# EAGLE design Indev 4 arduino (EAGLE 6.3)

## Sheet 1 of 2
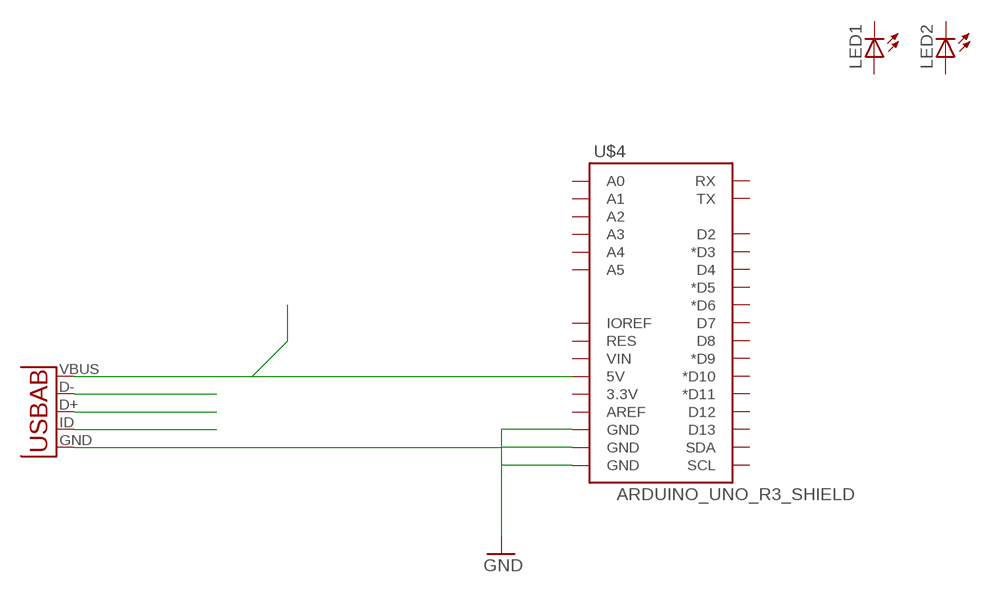
[diagram p0: schematic, sheet 1]

### Parts
LED1  LED0603  [LED-0603]
LED2  LED0603  [LED-0603]
U1  USB-AB  [USB-AB-MICRO-SMD]
U$4  ARDUINO_UNO_R3_SHIELD  [ARDUINO_UNO_R3_SHIELD]

### Nets
GND: U1.GND U$4.GND@0(GND) U$4.GND@1(GND) U$4.GND@2(GND) ; also sheet 2
USB_ID: U1.ID(USBID)
USB_VBUS: U1.VBUS U$4.5V
USBD_N: U1.D- ; also sheet 2
USBD_P: U1.D+ ; also sheet 2
Unconnected: LED1.A LED1.C LED2.A LED2.C U$4.3.3V U$4.A0 U$4.A1 U$4.A2 U$4.A3 U$4.A4 U$4.A5 U$4.AREF U$4.D2 U$4.D3(*D3) U$4.D4 U$4.D5(*D5) U$4.D6(*D6) U$4.D7 U$4.D8 U$4.D9(*D9) U$4.D10(*D10) U$4.D11(*D11) U$4.D12 U$4.D13 U$4.IOREF U$4.RES U$4.RX U$4.SCL U$4.SDA U$4.TX U$4.VIN

## Sheet 2 of 2
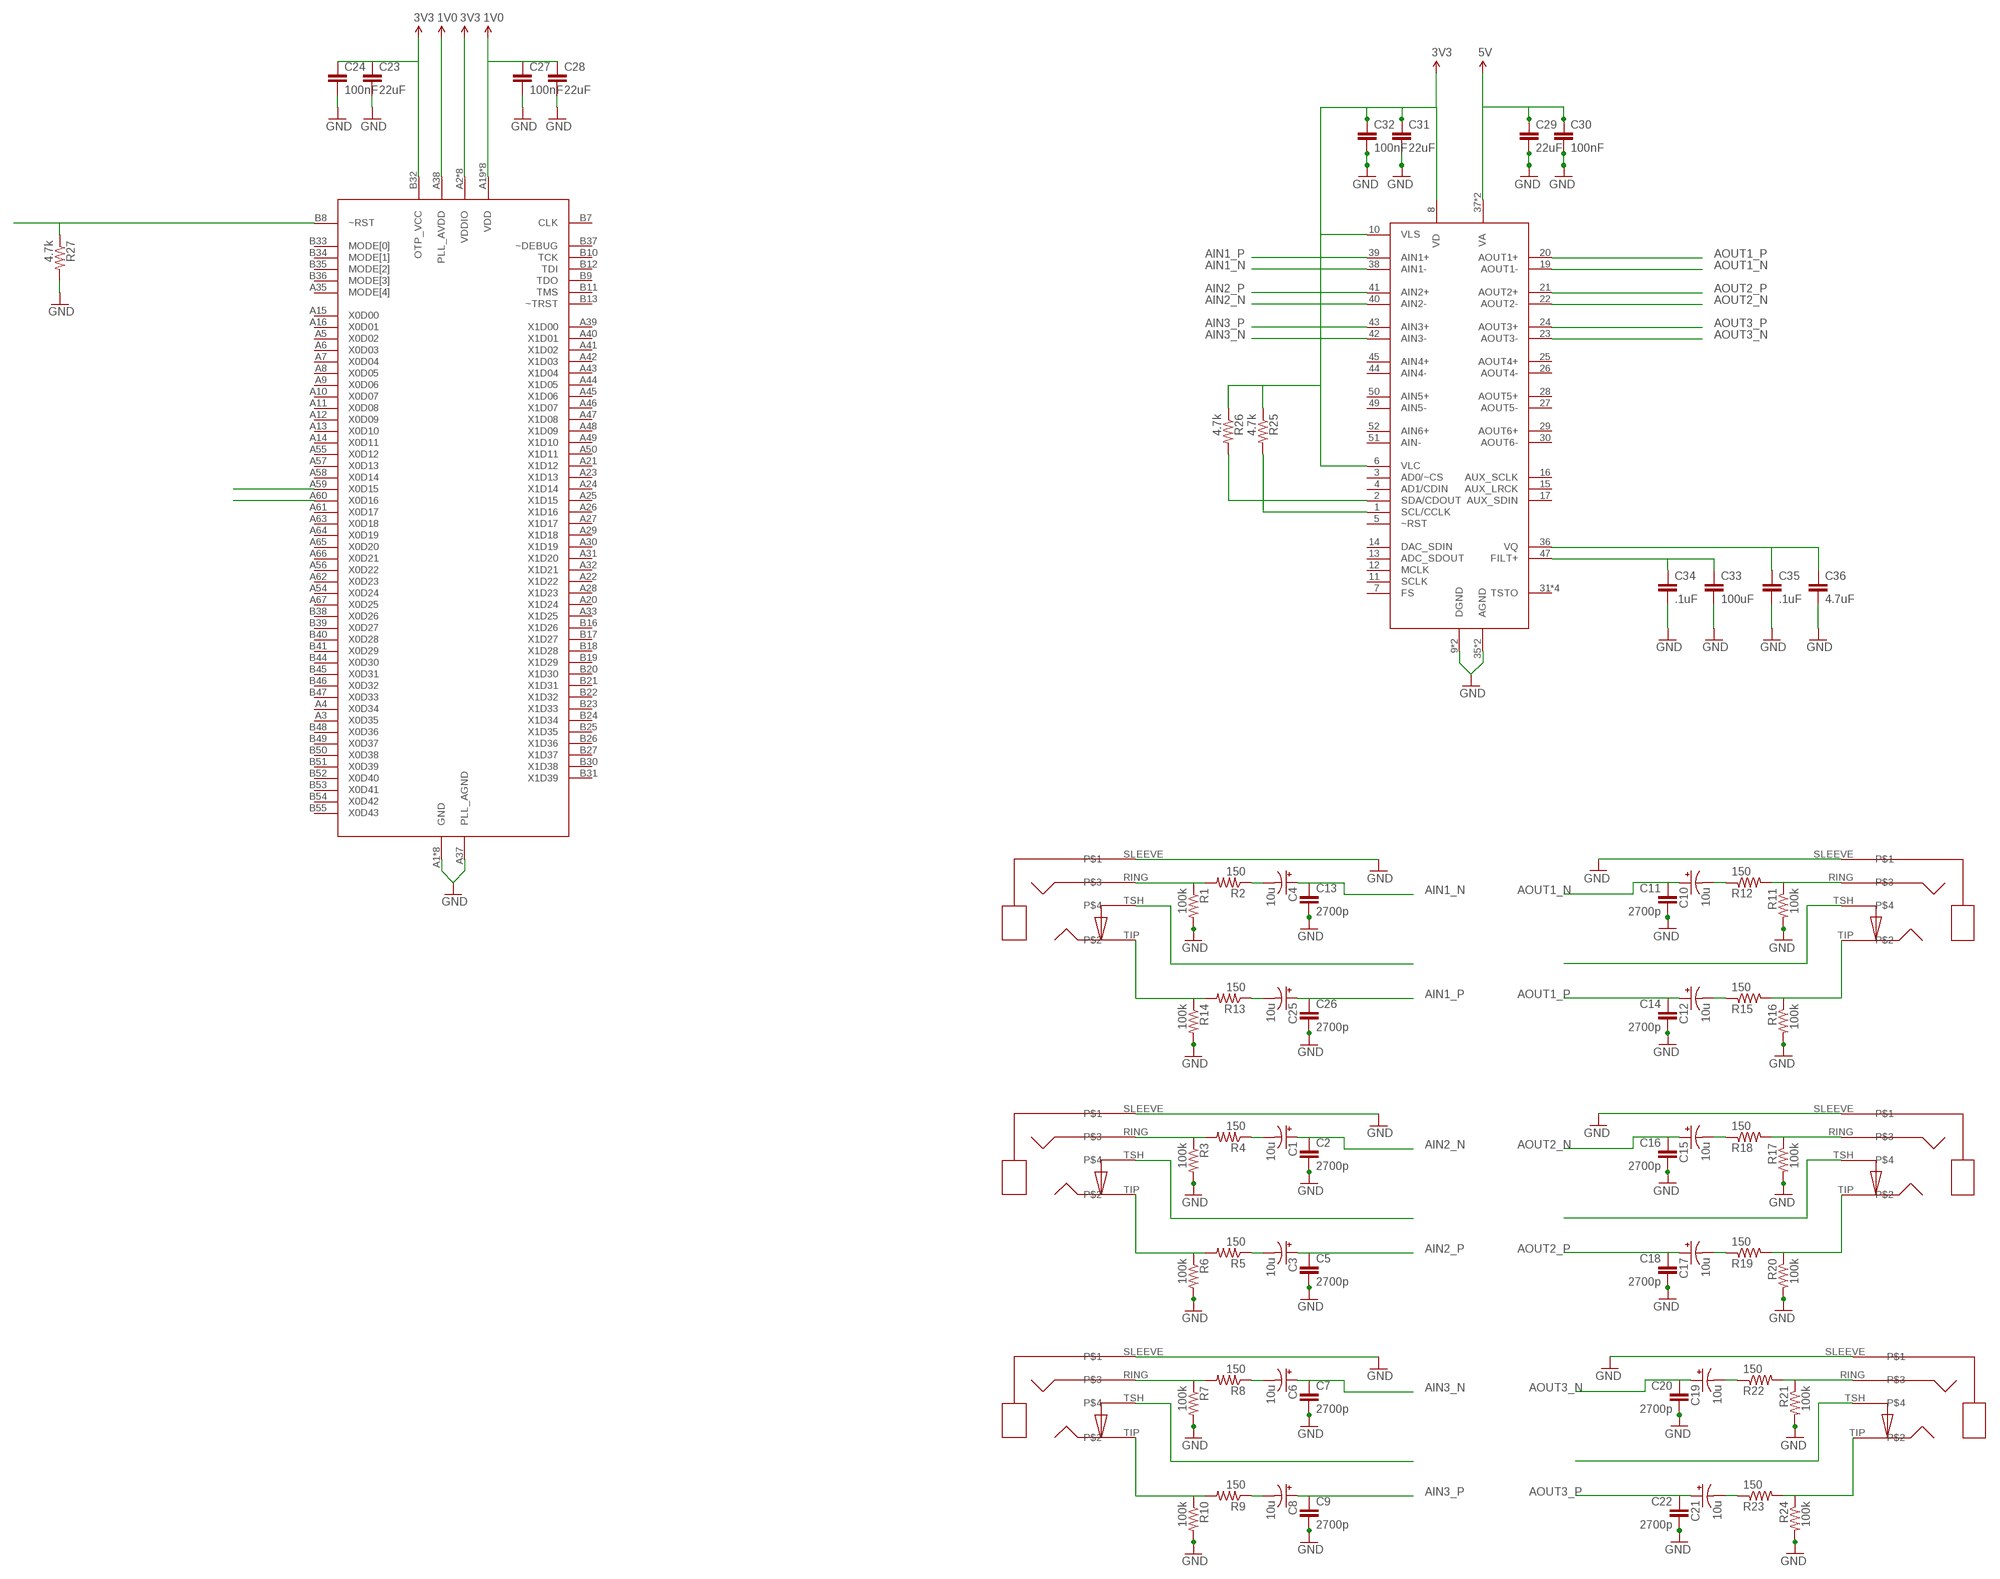
[diagram p1: schematic, sheet 2]

### Parts
C1  10u  CPOL-USB  [PANASONIC_B]
C2  2700p  CAP0402-CAP  [0402-CAP]
C3  10u  CPOL-USB  [PANASONIC_B]
C4  10u  CPOL-USB  [PANASONIC_B]
C5  2700p  CAP0402-CAP  [0402-CAP]
C6  10u  CPOL-USB  [PANASONIC_B]
C7  2700p  CAP0402-CAP  [0402-CAP]
C8  10u  CPOL-USB  [PANASONIC_B]
C9  2700p  CAP0402-CAP  [0402-CAP]
C10  10u  CPOL-USB  [PANASONIC_B]
C11  2700p  CAP0402-CAP  [0402-CAP]
C12  10u  CPOL-USB  [PANASONIC_B]
C13  2700p  CAP0402-CAP  [0402-CAP]
C14  2700p  CAP0402-CAP  [0402-CAP]
C15  10u  CPOL-USB  [PANASONIC_B]
C16  2700p  CAP0402-CAP  [0402-CAP]
C17  10u  CPOL-USB  [PANASONIC_B]
C18  2700p  CAP0402-CAP  [0402-CAP]
C19  10u  CPOL-USB  [PANASONIC_B]
C20  2700p  CAP0402-CAP  [0402-CAP]
C21  10u  CPOL-USB  [PANASONIC_B]
C22  2700p  CAP0402-CAP  [0402-CAP]
C23  22uF  CAP0402-CAP  [0402-CAP]
C24  100nF  CAP0402-CAP  [0402-CAP]
C25  10u  CPOL-USB  [PANASONIC_B]
C26  2700p  CAP0402-CAP  [0402-CAP]
C27  100nF  CAP0402-CAP  [0402-CAP]
C28  22uF  CAP0402-CAP  [0402-CAP]
C29  22uF  CAP0402-CAP  [0402-CAP]
C30  100nF  CAP0402-CAP  [0402-CAP]
C31  22uF  CAP0402-CAP  [0402-CAP]
C32  100nF  CAP0402-CAP  [0402-CAP]
C33  100uF  CAP0402-CAP  [0402-CAP]
C34  .1uF  CAP0402-CAP  [0402-CAP]
C35  .1uF  CAP0402-CAP  [0402-CAP]
C36  4.7uF  CAP0402-CAP  [0402-CAP]
J1  SJ3524_AUDIO  [SJ3524_AUDIO]
J2  SJ3524_AUDIO  [SJ3524_AUDIO]
J3  SJ3524_AUDIO  [SJ3524_AUDIO]
J4  SJ3524_AUDIO  [SJ3524_AUDIO]
J5  SJ3524_AUDIO  [SJ3524_AUDIO]
J6  SJ3524_AUDIO  [SJ3524_AUDIO]
R1  100k  R-US_R0402  [R0402]
R2  150  R-US_R0402  [R0402]
R3  100k  R-US_R0402  [R0402]
R4  150  R-US_R0402  [R0402]
R5  150  R-US_R0402  [R0402]
R6  100k  R-US_R0402  [R0402]
R7  100k  R-US_R0402  [R0402]
R8  150  R-US_R0402  [R0402]
R9  150  R-US_R0402  [R0402]
R10  100k  R-US_R0402  [R0402]
R11  100k  R-US_R0402  [R0402]
R12  150  R-US_R0402  [R0402]
R13  150  R-US_R0402  [R0402]
R14  100k  R-US_R0402  [R0402]
R15  150  R-US_R0402  [R0402]
R16  100k  R-US_R0402  [R0402]
R17  100k  R-US_R0402  [R0402]
R18  150  R-US_R0402  [R0402]
R19  150  R-US_R0402  [R0402]
R20  100k  R-US_R0402  [R0402]
R21  100k  R-US_R0402  [R0402]
R22  150  R-US_R0402  [R0402]
R23  150  R-US_R0402  [R0402]
R24  100k  R-US_R0402  [R0402]
R25  4.7k  R-US_R0402  [R0402]
R26  4.7k  R-US_R0402  [R0402]
R27  4.7k  R-US_R0402  [R0402]
U$1  XS1-L8A-128-QF124  [QFN-124]
U$3  CS42436  [QFP-52]

### Nets
1P0_PGOOD: R27.1 U$1.B8(~RST)
1V0: C27.1 C28.1 U$1.A19(VDD) U$1.A34(VDD) U$1.A38(PLL_AVDD) U$1.A53(VDD) U$1.A68(VDD) U$1.B15(VDD) U$1.B28(VDD) U$1.B43(VDD) U$1.B56(VDD)
3V3: C23.1 C24.1 U$1.A2(VDDIO) U$1.A17(VDDIO) U$1.A36(VDDIO) U$1.A51(VDDIO) U$1.B1(VDDIO) U$1.B14(VDDIO) U$1.B29(VDDIO) U$1.B32(OTP_VCC) U$1.B42(VDDIO)
5V: C29.1 C30.1 U$3.37(VA) U$3.46(VA)
AIN1_N: C4.+ C13.1 U$3.38(AIN1-)
AIN1_P: C25.+ C26.1 U$3.39(AIN1+)
AIN2_N: C1.+ C2.1 U$3.40(AIN2-)
AIN2_P: C3.+ C5.1 U$3.41(AIN2+)
AIN3_N: C6.+ C7.1 U$3.42(AIN3-)
AIN3_P: C8.+ C9.1 U$3.43(AIN3+)
AOUT1_N: C10.+ C11.1 U$3.19(AOUT1-)
AOUT1_P: C12.+ C14.1 U$3.20(AOUT1+)
AOUT2_N: C15.+ C16.1 U$3.22(AOUT2-)
AOUT2_P: C17.+ C18.1 U$3.21(AOUT2+)
AOUT3_N: C19.+ C20.1 U$3.23(AOUT3-)
AOUT3_P: C21.+ C22.1 U$3.24(AOUT3+)
GND: C2.2 C5.2 C7.2 C9.2 C11.2 C13.2 C14.2 C16.2 C18.2 C20.2 C22.2 C23.2 C24.2 C26.2 C27.2 C28.2 C29.2 C30.2 C31.2 C32.2 C33.2 C34.2 C35.2 C36.2 J1.SLEEVE J2.SLEEVE J3.SLEEVE J4.SLEEVE J5.SLEEVE J6.SLEEVE R1.2 R3.2 R6.2 R7.2 R10.2 R11.2 R14.2 R16.2 R17.2 R20.2 R21.2 R24.2 R27.2 U$1.A1(GND) U$1.A18(GND) U$1.A37(PLL_AGND) U$1.A52(GND) U$1.B2(GND) U$1.B4(GND) U$1.B5(GND) U$1.B6(GND) U$1.PAD(GND) U$3.9(DGND) U$3.18(DGND) U$3.35(AGND) U$3.48(AGND) ; also sheet 1
N$1: J1.TIP R13.2 R14.1
N$2: J1.RING R1.1 R2.2
N$3: C4.- R2.1
N$4: C33.1 C34.1 U$3.47(FILT+)
N$5: C25.- R13.1
N$6: C35.1 C36.1 U$3.36(VQ)
N$7: J1.TSH
N$8: J2.RING R3.1 R4.2
N$9: C1.- R4.1
N$11: J2.TIP R5.2 R6.1
N$12: C3.- R5.1
N$14: J2.TSH
N$15: J3.RING R7.1 R8.2
N$16: C6.- R8.1
N$18: J3.TIP R9.2 R10.1
N$19: C8.- R9.1
N$21: J3.TSH
N$22: J4.RING R11.1 R12.2
N$23: C10.- R12.1
N$25: J4.TIP R15.2 R16.1
N$26: C12.- R15.1
N$28: J4.TSH
N$29: J5.RING R17.1 R18.2
N$30: C15.- R18.1
N$31: R25.2 U$3.1(SCL/CCLK)
N$32: J5.TIP R19.2 R20.1
N$33: C17.- R19.1
N$34: R26.2 U$3.2(SDA/CDOUT)
N$35: J5.TSH
N$36: J6.RING R21.1 R22.2
N$37: C19.- R22.1
N$39: J6.TIP R23.2 R24.1
N$40: C21.- R23.1
N$42: J6.TSH
USBD_N: U$1.A59(X0D15) ; also sheet 1
USBD_P: U$1.A60(X0D16) ; also sheet 1
VD: C31.1 C32.1 R25.1 R26.1 U$3.6(VLC) U$3.8(VD) U$3.10(VLS) ; supply symbol labelled 3V3
Unconnected: U$1.A3(X0D35) U$1.A4(X0D34) U$1.A5(X0D02) U$1.A6(X0D03) U$1.A7(X0D04) U$1.A8(X0D05) U$1.A9(X0D06) U$1.A10(X0D07) U$1.A11(X0D08) U$1.A12(X0D09) U$1.A13(X0D10) U$1.A14(X0D11) U$1.A15(X0D00) U$1.A16(X0D01) U$1.A20(X1D24) U$1.A21(X1D12) U$1.A22(X1D22) U$1.A23(X1D13) U$1.A24(X1D14) U$1.A25(X1D15) U$1.A26(X1D16) U$1.A27(X1D17) U$1.A28(X1D23) U$1.A29(X1D18) U$1.A30(X1D19) U$1.A31(X1D20) U$1.A32(X1D21) U$1.A33(X1D25) U$1.A35(MODE[4]) U$1.A39(X1D00) U$1.A40(X1D01) U$1.A41(X1D02) U$1.A42(X1D03) U$1.A43(X1D04) U$1.A44(X1D05) U$1.A45(X1D06) U$1.A46(X1D07) U$1.A47(X1D08) U$1.A48(X1D09) U$1.A49(X1D10) U$1.A50(X1D11) U$1.A54(X0D24) U$1.A55(X0D12) U$1.A56(X0D22) U$1.A57(X0D13) U$1.A58(X0D14) U$1.A61(X0D17) U$1.A62(X0D23) U$1.A63(X0D18) U$1.A64(X0D19) U$1.A65(X0D20) U$1.A66(X0D21) U$1.A67(X0D25) U$1.B7(CLK) U$1.B9(TDO) U$1.B10(TCK) U$1.B11(TMS) U$1.B12(TDI) U$1.B13(~TRST) U$1.B16(X1D26) U$1.B17(X1D27) U$1.B18(X1D28) U$1.B19(X1D29) U$1.B20(X1D30) U$1.B21(X1D31) U$1.B22(X1D32) U$1.B23(X1D33) U$1.B24(X1D34) U$1.B25(X1D35) U$1.B26(X1D36) U$1.B27(X1D37) U$1.B30(X1D38) U$1.B31(X1D39) U$1.B33(MODE[0]) U$1.B34(MODE[1]) U$1.B35(MODE[2]) U$1.B36(MODE[3]) U$1.B37(~DEBUG) U$1.B38(X0D26) U$1.B39(X0D27) U$1.B40(X0D28) U$1.B41(X0D29) U$1.B44(X0D30) U$1.B45(X0D31) U$1.B46(X0D32) U$1.B47(X0D33) U$1.B48(X0D36) U$1.B49(X0D37) U$1.B50(X0D38) U$1.B51(X0D39) U$1.B52(X0D40) U$1.B53(X0D41) U$1.B54(X0D42) U$1.B55(X0D43) U$3.3(AD0/~CS) U$3.4(AD1/CDIN) U$3.5(~RST) U$3.7(FS) U$3.11(SCLK) U$3.12(MCLK) U$3.13(ADC_SDOUT) U$3.14(DAC_SDIN) U$3.15(AUX_LRCK) U$3.16(AUX_SCLK) U$3.17(AUX_SDIN) U$3.25(AOUT4+) U$3.26(AOUT4-) U$3.27(AOUT5-) U$3.28(AOUT5+) U$3.29(AOUT6+) U$3.30(AOUT6-) U$3.31(TSTO) U$3.32(TSTO) U$3.33(TSTO) U$3.34(TSTO) U$3.44(AIN4-) U$3.45(AIN4+) U$3.49(AIN5-) U$3.50(AIN5+) U$3.51(AIN-) U$3.52(AIN6+)

## Library data of the parts
C1 C3 C4 C6 C8 C10 C12 C15 C17 C19 C21 C25 = adafruit:CPOL-US: POLARIZED CAPACITOR, American symbol
C2 C5 C7 C9 C11 C13 C14 C16 C18 C20 C22 C26 C29-C36 = SparkFun-Capacitors:CAP: Capacitor Standard 0603 ceramic capacitor, and 0.1" leaded capacitor.
C23 C24 C27 C28 = 1x05smd:CAP: Capacitor Standard 0603 ceramic capacitor, and 0.1" leaded capacitor.
J1-J6 = Strutz Electronic Industries:SJ3524_AUDIO
LED1 LED2 = SparkFun-LED:LED: LEDs Standard schematic elements and footprints for 5mm, 3mm, 1206, and 0603 sized LEDs. 5mm - Spark Fun Electronics SKU : COM-00529 (and others)
R1-R27 = adafruit:R-US_: RESISTOR, American symbol
U1 = SparkFun-Connectors:USB-AB: This is a USB AB connector that is compatible with USB OTG. i.e. this connector can serve as a host or device
U$1 = Strutz Electronic Industries:XS1-L8A-128-QF124
U$3 = Strutz Electronic Industries:CS42436
U$4 = Strutz Electronic Industries:ARDUINO_UNO_R3_SHIELD

## Board
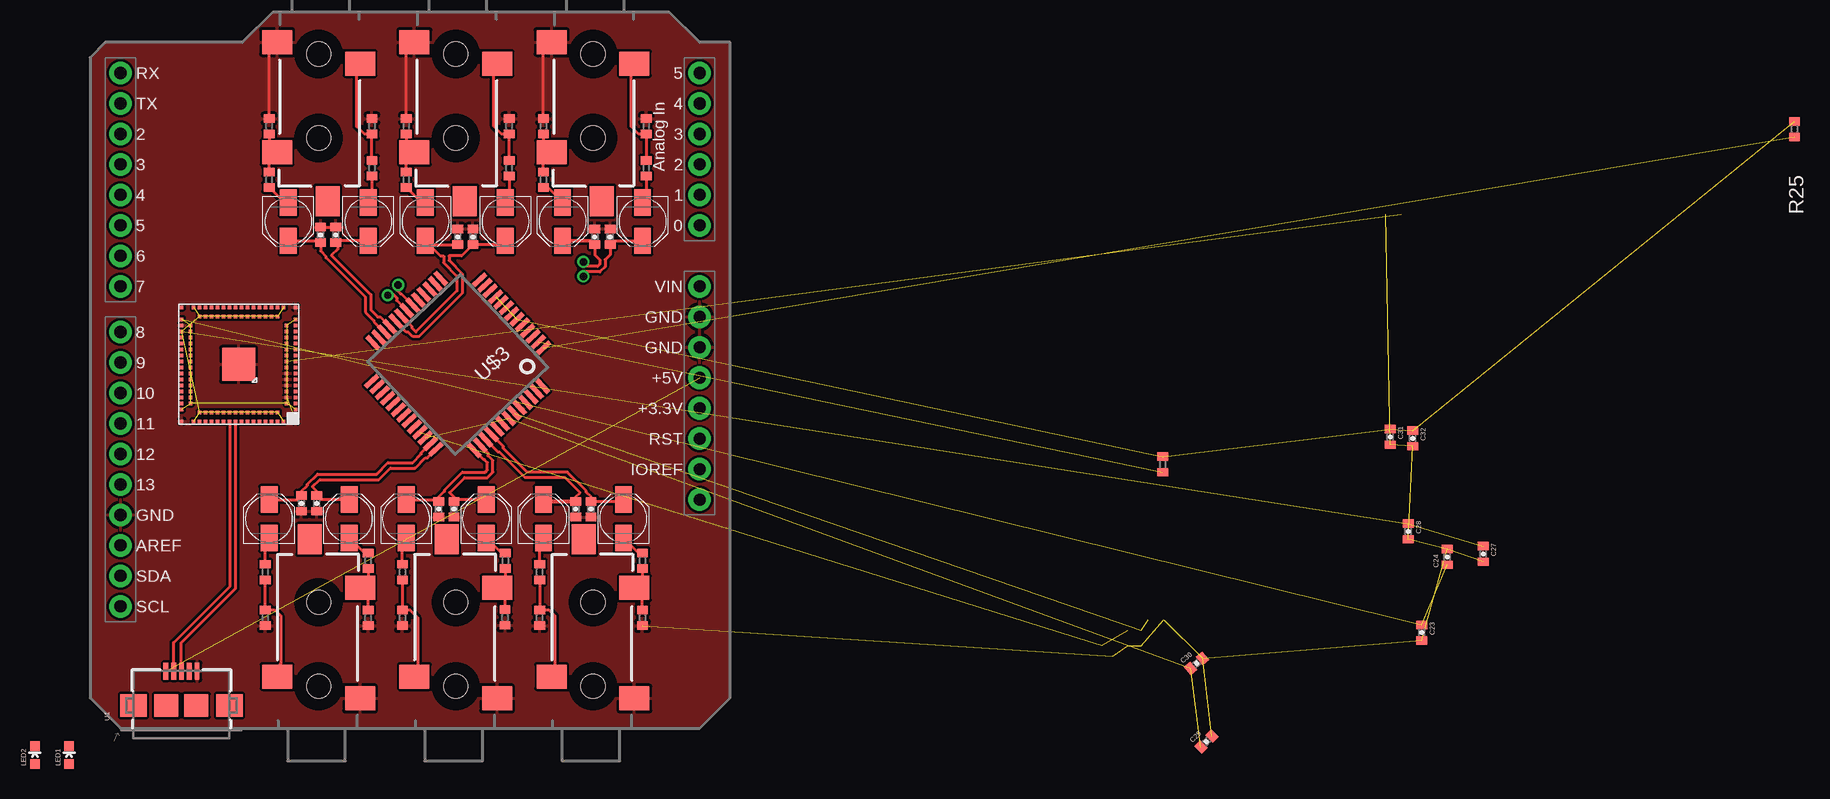
[diagram p2: board, top side]
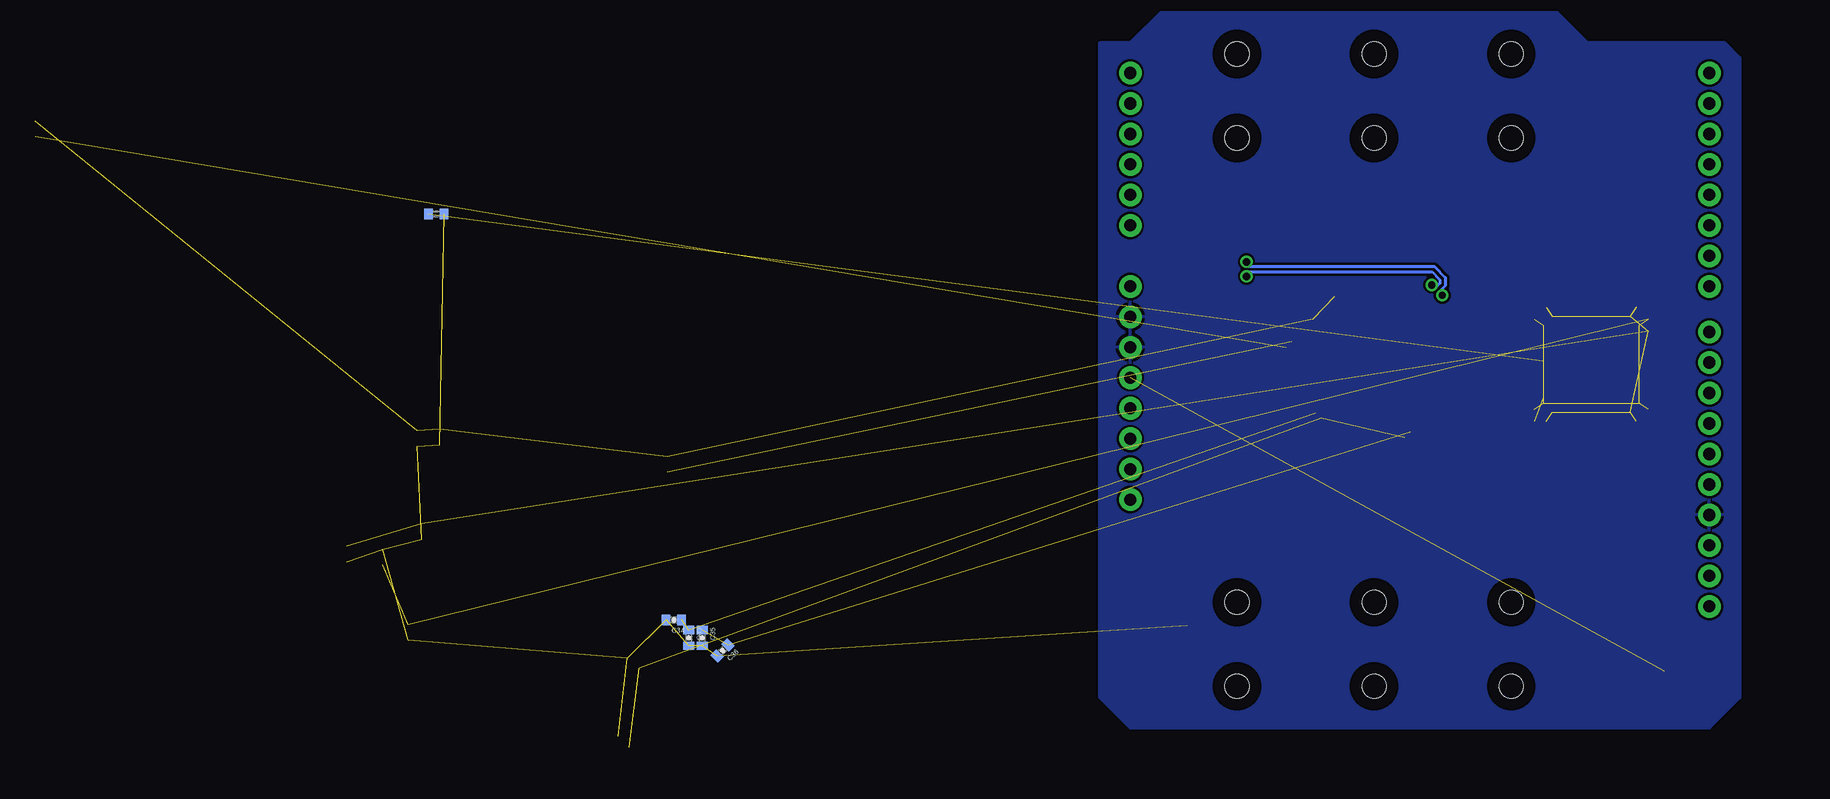
[diagram p3: board, bottom side, seen from below]

No outline drawn. Coordinates in mm, seen from the top.
Copper layers (1*16): Top 0.035mm / dielectric 1.5mm / Bottom 0.035mm
Design rules "default": minimum track width 10mil, minimum drill 24mil, track to track 8mil, track to pad 8mil, pad to pad 8mil, via to via 8mil, smd to smd 8mil, copper to edge 40mil, drill to drill 8mil, minimum pad ring 10mil, minimum via ring 8mil, stop-mask expansion 4mil, vias tented up to drill 0mil, thermal gap 10mil

### Footprints (pad centres in the part's own frame; a part is rotated, then mirrored left to right if it is on the bottom)
PANASONIC_B = smd 2.2 x 1.4: + 1.6,0; - -1.6,0
0402-CAP = smd 0.7 x 0.9: 1 -0.65,0; 2 0.65,0
SJ3524_AUDIO = smd 2 x 2.5: RING -0.78,3.45; SLEEVE -2.58,-3.45; TIP 6.62,-3.45 | smd 2.5 x 2: TSH 10.67,0.75 | hole 2: -1.58,0; 5.42,0
LED-0603 = smd 0.8 x 0.8: A 0,-0.75; C 0,0.75
R0402 = smd 0.7 x 0.9: 1 -0.65,0; 2 0.65,0
USB-AB-MICRO-SMD = smd 1.4 x 0.4: D+ 2.85,0; D- 2.85,0.65; GND 2.85,-1.3; ID 2.85,-0.65; VBUS 2.85,1.3 | smd 1.9 x 2: P$6 0,1.25; P$7 0,-1.25 | smd 1.9 x 2.2: P$8 0,4; P$9 0,-4
QFN-124 = smd 0.3 x 0.3: A1 -4.75,4.75; A2 -4.75,3.75; A3 -4.75,3.25; A4 -4.75,2.75; A5 -4.75,2.25; A6 -4.75,1.75; A7 -4.75,1.25; A8 -4.75,0.75; A9 -4.75,0.25; A10 -4.75,-0.25; A11 -4.75,-0.75; A12 -4.75,-1.25; A13 -4.75,-1.75; A14 -4.75,-2.25; A15 -4.75,-2.75; A16 -4.75,-3.25; A17 -4.75,-3.75; A18 -4.75,-4.75; A19 -3.75,-4.75; A20 -3.25,-4.75; A21 -2.75,-4.75; A22 -2.25,-4.75; A23 -1.75,-4.75; A24 -1.25,-4.75; A25 -0.75,-4.75; A26 -0.25,-4.75; A27 0.25,-4.75; A28 0.75,-4.75; A29 1.25,-4.75; A30 1.75,-4.75; A31 2.25,-4.75; A32 2.75,-4.75; A33 3.25,-4.75; A34 3.75,-4.75; A35 4.75,-4.75; A36 4.75,-3.75; A37 4.75,-3.25; A38 4.75,-2.75; A39 4.75,-2.25; A40 4.75,-1.75; A41 4.75,-1.25; A42 4.75,-0.75; A43 4.75,-0.25; A44 4.75,0.25; A45 4.75,0.75; A46 4.75,1.25; A47 4.75,1.75; A48 4.75,2.25; A49 4.75,2.75; A50 4.75,3.25; A51 4.75,3.75; A52 4.75,4.75; A53 3.75,4.75; A54 3.25,4.75; A55 2.75,4.75; A56 2.25,4.75; A57 1.75,4.75; A58 1.25,4.75; A59 0.75,4.75; A60 0.25,4.75; A61 -0.25,4.75; A62 -0.75,4.75; A63 -1.25,4.75; A64 -1.75,4.75; A65 -2.25,4.75; A66 -2.75,4.75; A67 -3.25,4.75; A68 -3.75,4.75; B1 -4,3.25; B2 -4,2.75; B3 -4,2.25; B4 -4,1.75; B5 -4,1.25; B6 -4,0.75; B7 -4,0.25; B8 -4,-0.25; B9 -4,-0.75; B10 -4,-1.25; B11 -4,-1.75; B12 -4,-2.25; B13 -4,-2.75; B14 -4,-3.25; B15 -3.25,-4; B16 -2.75,-4; B17 -2.25,-4; B18 -1.75,-4; B19 -1.25,-4; B20 -0.75,-4; B21 -0.25,-4; B22 0.25,-4; B23 0.75,-4; B24 1.25,-4; B25 1.75,-4; B26 2.25,-4; B27 2.75,-4; B28 3.25,-4; B29 4,-3.25; B30 4,-2.75; B31 4,-2.25; B32 4,-1.75; B33 4,-1.25; B34 4,-0.75; B35 4,-0.25; B36 4,0.25; B37 4,0.75; B38 4,1.25; B39 4,1.75; B40 4,2.25; B41 4,2.75; B42 4,3.25; B43 3.25,4; B44 2.75,4; B45 2.25,4; B46 1.75,4; B47 1.25,4; B48 0.75,4; B49 0.25,4; B50 -0.25,4; B51 -0.75,4; B52 -1.25,4; B53 -1.75,4; B54 -2.25,4; B55 -2.75,4; B56 -3.25,4 | smd 2.75 x 2.75: PAD 0,0
QFP-52 = smd 1.4 x 0.4: 1 -6.175,3.9; 2 -6.175,3.25; 3 -6.175,2.6; 4 -6.175,1.95; 5 -6.175,1.3; 6 -6.175,0.65; 7 -6.175,0; 8 -6.175,-0.65; 9 -6.175,-1.3; 10 -6.175,-1.95; 11 -6.175,-2.6; 12 -6.175,-3.25; 13 -6.175,-3.9; 27 6.175,-3.9; 28 6.175,-3.25; 29 6.175,-2.6; 30 6.175,-1.95; 31 6.175,-1.3; 32 6.175,-0.65; 33 6.175,0; 34 6.175,0.65; 35 6.175,1.3; 36 6.175,1.95; 37 6.175,2.6; 38 6.175,3.25; 39 6.175,3.9 | smd 0.4 x 1.4: 14 -3.9,-6.175; 15 -3.25,-6.175; 16 -2.6,-6.175; 17 -1.95,-6.175; 18 -1.3,-6.175; 19 -0.65,-6.175; 20 0,-6.175; 21 0.65,-6.175; 22 1.3,-6.175; 23 1.95,-6.175; 24 2.6,-6.175; 25 3.25,-6.175; 26 3.9,-6.175; 40 3.9,6.175; 41 3.25,6.175; 42 2.6,6.175; 43 1.95,6.175; 44 1.3,6.175; 45 0.65,6.175; 46 0,6.175; 47 -0.65,6.175; 48 -1.3,6.175; 49 -1.95,6.175; 50 -2.6,6.175; 51 -3.25,6.175; 52 -3.9,6.175
ARDUINO_UNO_R3_SHIELD = drill 1.016 pad 1.88: 3.3V 24.13,1.27; 5V 24.13,3.81; A0 24.13,16.51; A1 24.13,19.05; A2 24.13,21.59; A3 24.13,24.13; A4 24.13,26.67; A5 24.13,29.21; AREF -24.13,-10.16; D2 -24.13,24.13; D3 -24.13,21.59; D4 -24.13,19.05; D5 -24.13,16.51; D6 -24.13,13.97; D7 -24.13,11.43; D8 -24.13,7.62; D9 -24.13,5.08; D10 -24.13,2.54; D11 -24.13,0; D12 -24.13,-2.54; D13 -24.13,-5.08; GND@0 24.13,6.35; GND@1 24.13,8.89; GND@2 -24.13,-7.62; IOREF 24.13,-3.81; NC 24.13,-6.35; RES 24.13,-1.27; RX -24.13,29.21; SCL -24.13,-15.24; SDA -24.13,-12.7; TX -24.13,26.67; VIN 24.13,11.43

### Placement (x,y rotation side)
C1  6.03,49.21 90 top
C2  8.73,50.01 270 top
C3  12.7,49.21 90 top
C4  -5.4,49.21 90 top
C5  10,50.01 270 top
C6  17.46,49.21 90 top
C7  20.16,50.01 270 top
C8  24.13,49.21 90 top
C9  21.43,50.01 270 top
C10  25.72,73.98 270 top
C11  23.02,72.71 90 top
C12  19.05,73.98 270 top
C13  -2.7,50.48 270 top
C14  21.75,72.71 90 top
C15  14.29,73.98 270 top
C16  11.59,72.71 90 top
C17  7.62,73.98 270 top
C18  10.32,72.71 90 top
C19  2.86,73.98 270 top
C20  0.16,72.87 90 top
C21  -3.81,73.98 270 top
C22  -1.11,72.87 90 top
C23  90.66,39.72 270 top
C24  92.77,46.03 90 top
C25  1.27,49.21 90 top
C26  -1.43,50.48 270 top
C27  95.77,46.28 270 top
C28  89.52,48.16 270 top
C29  72.71,30.64 45 top
C30  71.89,37.16 40 top
C31  88.02,56.03 270 top
C32  89.89,55.91 270 top
C33  67.27,39.28 270 bottom
C34  68.52,40.78 180 bottom
C35  66.14,39.28 270 bottom
C36  64.46,38.23 225 bottom
J1  -1.27,36.83 90 top
J2  10.16,36.83 90 top
J3  21.59,36.83 90 top
J4  21.59,86.36 270 top
J5  10.16,86.36 270 top
J6  -1.27,86.36 270 top
LED1  -22.07,29.53 0 top
LED2  -24.92,29.53 0 top
R1  -5.71,40.96 270 top
R2  -5.71,44.77 270 top
R3  5.71,40.96 270 top
R4  5.71,44.77 270 top
R5  14.29,45.72 270 top
R6  14.26,40.98 270 top
R7  17.14,40.96 270 top
R8  17.14,44.77 270 top
R9  25.72,45.72 270 top
R10  25.72,40.96 270 top
R11  26.04,81.92 90 top
R12  26.04,78.42 90 top
R13  2.86,45.72 270 top
R14  2.86,40.96 270 top
R15  17.46,77.47 90 top
R16  17.46,81.92 90 top
R17  14.61,81.92 90 top
R18  14.61,78.42 90 top
R19  6.03,77.47 90 top
R20  6.03,81.92 90 top
R21  3.17,81.92 90 top
R22  3.17,78.42 90 top
R23  -5.4,77.47 90 top
R24  -5.4,81.92 90 top
R25  121.72,81.67 270 top
R26  69.07,53.73 270 top
R27  88.31,74.61 0 bottom
U1  -12.7,33.66 90 top
U$1  -7.94,62.07 180 top
U$3  10.32,62.07 223.3 top
U$4  6.35,57.15 0 top

### Tracks (layer width: path | path; a pad name or v marks a point on that pad's centre or on a via)
1P0_PGOOD  (1 unrouted)
1V0  (10 unrouted)
3V3  (10 unrouted)
5V  (3 unrouted)
AIN1_N
  Top 0.254: C4.+ -3.02,50.81 C13.1 -2.7,51.51 -2.23,51.98 -2.23,52.07 -1.36,52.93 3.56,52.93 4.51,53.89 6.57,53.89 7.3,54.61 7.3,54.72 U$3.38
AIN1_P
  Top 0.254: C26.1 -1.11,50.81 C25.+ -1.12,50.81 -1.43,51.12 -1.43,51.51 -1.79,51.86 -1.18,52.48 3.75,52.48 4.7,53.43 6.76,53.43 7.62,54.29 7.79,54.29 U$3.39
AIN2_N
  Top 0.254: C1.+ 8.57,50.81 C2.1 8.73,51.03 9.21,51.5 9.21,51.6 10.7,53.09 12.61,53.09 12.79,53.28 12.79,53.88 12.54,54.13 12.49,54.13 U$3.40
AIN2_P
  Top 0.254: C5.1 10.16,50.81 C3.+ 10.17,50.81 10,50.64 10,51.03 9.64,51.39 10.89,52.63 12.79,52.63 13.25,53.09 13.25,54.07 12.86,54.45 12.86,54.67 U$3.41
AIN3_N
  Top 0.254: C7.1 17.62,50.66 C6.+ 17.62,50.64 20.16,50.64 20.16,51.03 20.52,51.39 19.27,52.63 15.94,52.63 13.81,54.77 13.69,54.77 U$3.42
AIN3_P
  Top 0.254: C8.+ 23.97,50.66 C9.1 21.43,51.03 21.02,51.44 21.02,51.53 19.46,53.09 16.13,53.09 14.13,55.09 14.13,55.24 U$3.43
AOUT1_N  (via drill 0.6)
  Top 0.254: C10.+ 23.34,72.38 C11.1 23.02,71.21 22.61,70.8 22.61,70.23 22.16,69.78 20.8,69.78 v20.8,69.4 | v5.35,68.69 5.08,68.42 5.56,67.95 5.62,67.95 U$3.19
  Bottom 0.254: v20.8,69.4 20.8,69.78 5.33,69.78 4.67,69.12 4.67,68.83 5.08,68.42 v5.35,68.69
AOUT1_P  (via drill 0.6)
  Top 0.254: C14.1 21.43,72.38 C12.+ 21.29,72.38 21.75,71.91 21.75,71.21 22.16,70.8 22.16,70.42 21.97,70.24 20.8,70.24 v20.8,70.61 | v4.49,67.83 4.76,68.1 5.24,67.62 5.24,67.41 U$3.20
  Bottom 0.254: v20.8,70.61 20.8,70.24 5.14,70.24 4.22,69.31 4.22,68.64 4.76,68.1 v4.49,67.83
AOUT2_N
  Top 0.254: C15.+ 13.97,72.06 C16.1 10.65,71.12 9.6,71.12 9.6,70.74 10.71,69.63 10.71,68.01 7.08,64.38 6.57,64.38 6.19,64.77 6.04,64.77 U$3.22
AOUT2_P
  Top 0.254: C18.1 7.94,72.06 C17.+ 8.88,71.12 9.14,71.12 9.14,70.55 10.25,69.44 10.25,68.2 6.83,64.78 6.51,65.09 6.51,65.22 U$3.21
AOUT3_N
  Top 0.254: C20.1 0.32,72.38 C19.+ 0.33,72.38 0.32,72.39 0.32,71.69 -0.2,71.17 3.09,67.88 3.09,66.61 3.65,66.04 3.85,66.04 U$3.23
AOUT3_P
  Top 0.254: C21.+ -1.27,72.38 C22.1 -1.11,71.53 -0.64,71.05 -0.64,70.96 2.63,67.69 2.63,66.42 3.33,65.72 3.33,65.64 U$3.24
GND  (15 unrouted)
  Top 0.254: R24.2 -5.4,88.26 J6.SLEEVE | R20.2 6.03,88.26 J5.SLEEVE | R16.2 17.46,88.26 J4.SLEEVE | C22.2 C20.2
  pour Bottom: -20.32,34.29 -17.78,31.75 30.48,31.75 33.02,34.29 33.02,88.9 30.48,88.9 27.94,91.44 -5.08,91.44 -7.62,88.9 -19.05,88.9 -20.32,87.63
  pour Top: -20.32,34.29 -17.78,31.75 30.48,31.75 33.02,34.29 33.02,88.9 30.48,88.9 27.94,91.44 -5.08,91.44 -7.62,88.9 -19.05,88.9 -20.32,87.63
N$1
  Top 0.254: R13.2 2.86,44.13 2.54,43.81 | 2.54,43.81 J1.TIP | R14.1 2.86,43.5 2.54,43.81
N$2
  Top 0.254: J1.RING -4.92,36.25 -4.92,36.67 -4.45,37.15 -4.45,41.12 -4.94,41.61 R1.1 R2.2
N$3
  Top 0.254: R2.1 -5.71,46.51 -5.4,46.83 C4.-
N$4  (2 unrouted)
N$5
  Top 0.254: R13.1 2.51,46.37 C25.-
N$6  (2 unrouted)
N$8
  Top 0.254: R4.2 R3.1 6.33,41.61 6.99,40.96 6.99,36.33 J2.RING
N$9
  Top 0.254: R4.1 5.71,47.3 C1.-
N$11
  Top 0.254: R6.1 14.26,42.8 J2.TIP 14.29,44.13 R5.2
N$12
  Top 0.254: R5.1 13.94,46.37 C3.-
N$15
  Top 0.254: J3.RING 18.41,36.33 18.41,41.12 17.92,41.61 R7.1 R8.2
N$16
  Top 0.254: R8.1 17.14,47.3 C6.-
N$18
  Top 0.254: R9.2 25.72,44.13 J3.TIP 25.72,42.77 R10.1
N$19
  Top 0.254: R9.1 25.37,46.37 C8.-
N$22
  Top 0.254: R12.2 R11.1 25.41,81.27 24.77,81.92 24.77,86.86 J4.RING
N$23
  Top 0.254: R12.1 26.04,75.89 C10.-
N$25
  Top 0.254: R15.2 17.46,79.06 J4.TIP 17.46,80.42 R16.1
N$26
  Top 0.254: R15.1 17.81,76.82 C12.-
N$29
  Top 0.254: R18.2 R17.1 13.98,81.27 13.34,81.92 13.34,86.55 J5.RING
N$30
  Top 0.254: R18.1 14.61,75.89 C15.-
N$31  (1 unrouted)
N$32
  Top 0.254: R19.2 6.03,79.06 J5.TIP 6.03,80.42 R20.1
N$33
  Top 0.254: C17.- 7.28,75.58 R19.1
N$34  (1 unrouted)
N$36
  Top 0.254: J6.RING 1.91,86.86 1.91,81.92 2.56,81.27 R21.1 R22.2
N$37
  Top 0.254: R22.1 3.17,75.89 C19.-
N$39
  Top 0.254: R24.1 -5.4,80.42 J6.TIP -5.4,79.06 R23.2
N$40
  Top 0.254: C21.- -4.16,75.58 R23.1
USB_VBUS  (1 unrouted)
USBD_N
  Top 0.254: U1.D- -13.35,38.88 -8.64,43.59 -8.64,57.31 -8.68,57.31 U$1.A59
USBD_P
  Top 0.254: U1.D+ -12.7,38.89 -8.19,43.4 U$1.A60
VD  (6 unrouted)